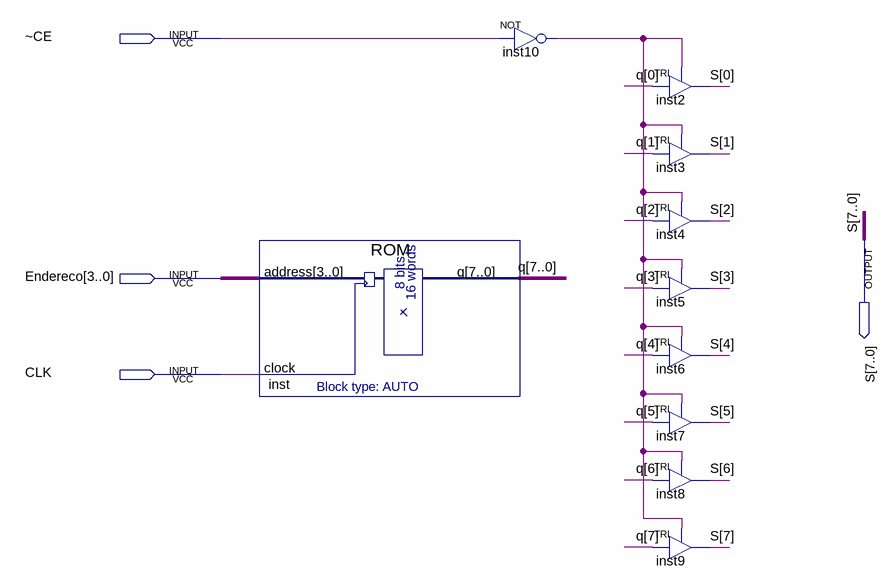
[diagram p0: schematic sheet]
// Quartus schematic RAM.bdf as structural Verilog: 10 symbols, 4 pins
module RAM (
  input  \~CE ,
  input  [3:0] Endereco,
  input  CLK,
  output [7:0] S
);

  wire inst10_out;
  wire [7:0] q;

  ROM inst (.address(Endereco), .clock(CLK), .q(q));
  not inst10 (inst10_out, \~CE );
  TRI inst2 (.IN(q[0]), .OE(inst10_out), .OUT(S[0]));
  TRI inst3 (.IN(q[1]), .OE(inst10_out), .OUT(S[1]));
  TRI inst4 (.IN(q[2]), .OE(inst10_out), .OUT(S[2]));
  TRI inst5 (.IN(q[3]), .OE(inst10_out), .OUT(S[3]));
  TRI inst6 (.IN(q[4]), .OE(inst10_out), .OUT(S[4]));
  TRI inst7 (.IN(q[5]), .OE(inst10_out), .OUT(S[5]));
  TRI inst8 (.IN(q[6]), .OE(inst10_out), .OUT(S[6]));
  TRI inst9 (.IN(q[7]), .OE(inst10_out), .OUT(S[7]));
endmodule
